# Altium schematic sheet 2S_BATTERY_PROTECTION_SCH.SchDoc
size 299 x 199 mm
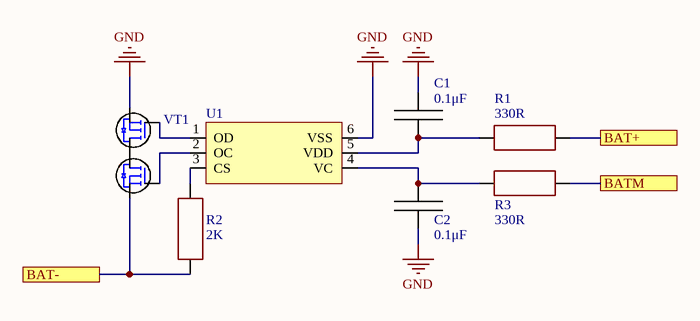
[diagram p0: 2S_BATTERY_PROTECTION_SCH.SchDoc]

## Parts
C1  value 0.1μF  [CAP: 0402]  (hidden comment: Cap_0402)
C2  value 0.1μF  [CAP: 0402]  (hidden comment: Cap_0402)
R1  value 330R  [RES: 0402]
R2  value 2K  [RES: 0402]
R3  value 330R  [RES: 0402]
U1  HY2120  [SOT-23-6]  (value not drawn)
VT1  8205A  [SOT-23-6]  (value not drawn)

## Ports
BAT+, BAT-, BATM

## Nets
GND: C1.2 C2.1 U1.6(VSS) VT1.1
BAT+: R1.2 ; port BAT+
BAT-: R2.1 VT1.3 ; port BAT-
BATM: R3.2 ; port BATM
NetC1_1: C1.1 R1.1 U1.5(VDD)
NetC2_2: C2.2 R3.1 U1.4(VC)
NetR2_2: R2.2 U1.3(CS)
NetU1_1: U1.1(OD) VT1.6
NetU1_2: U1.2(OC) VT1.4
NetVT1_2: VT1.2 VT1.5

## Library data of the parts
C1 C2 = Cap_0402: TypeDielectric: X7R(X5R); Voltage: ??V; Package/Case: 0402; Temperature: -55...+125°C(-55...+85°C); Product Category: Capacitors
R1-R3 = Resistor_0402: Tolerance: ±5%; Product Category: Resistors; Package/Case: 0402; Temperature: -55...+125°C
U1 = HY2120: 2-cell lithium-ion/lithium polymer rechargeable battery / protection; Manufacturer: HYCON; Datasheet: https://static.chipdip.ru/lib/671/DOC012671868.pdf; HelpURL: https://aliexpress.ru/item/32858079670.html?sku_id=65323825149&spm=a2g2w.productlist.search_results.5.6e4d5adf5VsdVe; Package/Case: SOT-23-6; Product Category: Battery protection; Value: HY2120
VT1 = 8205A: MOSFET N-CHANNEL 20V 5A; pin to pad: 2>2+5 5>2+5; Manufacturer: UMW; Datasheet: https://static.chipdip.ru/lib/303/DOC021303523.pdf; HelpURL: https://www.chipdip.by/product/8205a; Package/Case: SOT-23-6; Product Category: MOSFET; Value: 8205A